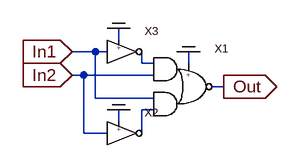
[diagram p0: schematic nm_xnor.asc]
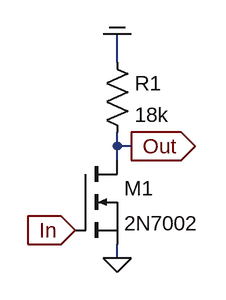
[diagram p1: sub-circuit nm_not.asc]
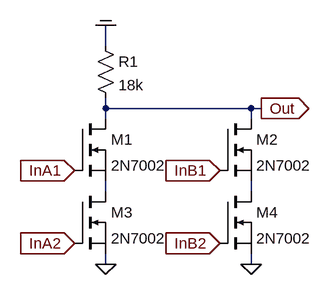
[diagram p2: sub-circuit nm_aoi2x2.asc]
nm_xnor.asc, the LTspice schematic file:
Version 4
SHEET 1 880 680
WIRE 320 64 320 48
WIRE 288 80 256 80
WIRE 304 80 288 80
WIRE 352 96 352 80
WIRE 368 96 352 96
WIRE 416 96 416 80
WIRE 272 112 256 112
WIRE 368 112 272 112
WIRE 464 128 448 128
WIRE 288 144 288 80
WIRE 368 144 288 144
WIRE 368 160 352 160
WIRE 320 176 320 160
WIRE 272 192 272 112
WIRE 304 192 272 192
WIRE 352 192 352 160
FLAG 256 80 In1
IOPIN 256 80 In
FLAG 464 128 Out
IOPIN 464 128 Out
FLAG 256 112 In2
IOPIN 256 112 In
FLAG 320 48 COM
FLAG 320 160 COM
FLAG 416 80 COM
SYMBOL nm_not 320 192 R0
SYMATTR InstName X2
SYMBOL nm_not 320 80 R0
SYMATTR InstName X3
SYMBOL nm_aoi2x2 400 128 R0
SYMATTR InstName X1

nm_not.asc, the sub-circuit schematic file:
Version 4
SHEET 1 880 680
WIRE 224 32 224 0
WIRE 224 128 224 112
WIRE 240 128 224 128
WIRE 224 144 224 128
WIRE 224 256 224 240
FLAG 224 256 0
FLAG 176 224 In
IOPIN 176 224 In
FLAG 240 128 Out
IOPIN 240 128 Out
FLAG 224 0 COM
SYMBOL nmos 176 144 R0
SYMATTR InstName M1
SYMATTR Value 2N7002
SYMBOL res 208 16 R0
SYMATTR InstName R1
SYMATTR Value 18k

nm_aoi2x2.asc, the sub-circuit schematic file:
Version 4
SHEET 1 1092 680
WIRE 224 32 224 0
WIRE 224 128 224 112
WIRE 448 128 224 128
WIRE 464 128 448 128
WIRE 224 144 224 128
WIRE 448 144 448 128
WIRE 224 256 224 240
WIRE 448 256 448 240
WIRE 224 368 224 352
WIRE 448 368 448 352
FLAG 176 224 InA1
IOPIN 176 224 In
FLAG 464 128 Out
IOPIN 464 128 Out
FLAG 224 0 COM
FLAG 448 368 0
FLAG 400 224 InB1
IOPIN 400 224 In
FLAG 224 368 0
FLAG 176 336 InA2
IOPIN 176 336 In
FLAG 400 336 InB2
IOPIN 400 336 In
SYMBOL nmos 176 144 R0
SYMATTR InstName M1
SYMATTR Value 2N7002
SYMBOL res 208 16 R0
SYMATTR InstName R1
SYMATTR Value 18k
SYMBOL nmos 400 144 R0
SYMATTR InstName M2
SYMATTR Value 2N7002
SYMBOL nmos 176 256 R0
SYMATTR InstName M3
SYMATTR Value 2N7002
SYMBOL nmos 400 256 R0
SYMATTR InstName M4
SYMATTR Value 2N7002

The netlist it stands for:
* nm_xnor.asc
XX2 In2 N002 COM nm_not
XX3 In1 N001 COM nm_not
XX1 In2 Out COM N001 In1 N002 nm_aoi2x2

* block symbol definitions
.subckt nm_not In Out COM
M1 Out In 0 0 2N7002
R1 COM Out 18k
.ends nm_not

.subckt nm_aoi2x2 InA2 Out COM InA1 InB1 InB2
M1 Out InA1 N001 N001 2N7002
R1 COM Out 18k
M2 Out InB1 N002 N002 2N7002
M3 N001 InA2 0 0 2N7002
M4 N002 InB2 0 0 2N7002
.ends nm_aoi2x2

.model NMOS NMOS
.model PMOS PMOS
.lib standard.mos
.backanno
.end